# Altium schematic sheet DOC REVISION HISTORY.SchDoc
size A4; Organization: Deutsches Zentrum für Luft-; Address1: und Raumfahrt e.V. (DLR); Address2: Institut für Materialphysik; Address3: im Weltraum; Address4: Linder Höhe - 51147 Köln; DocumentNumber: 3; SheetNumber: 3; SheetTotal: 4
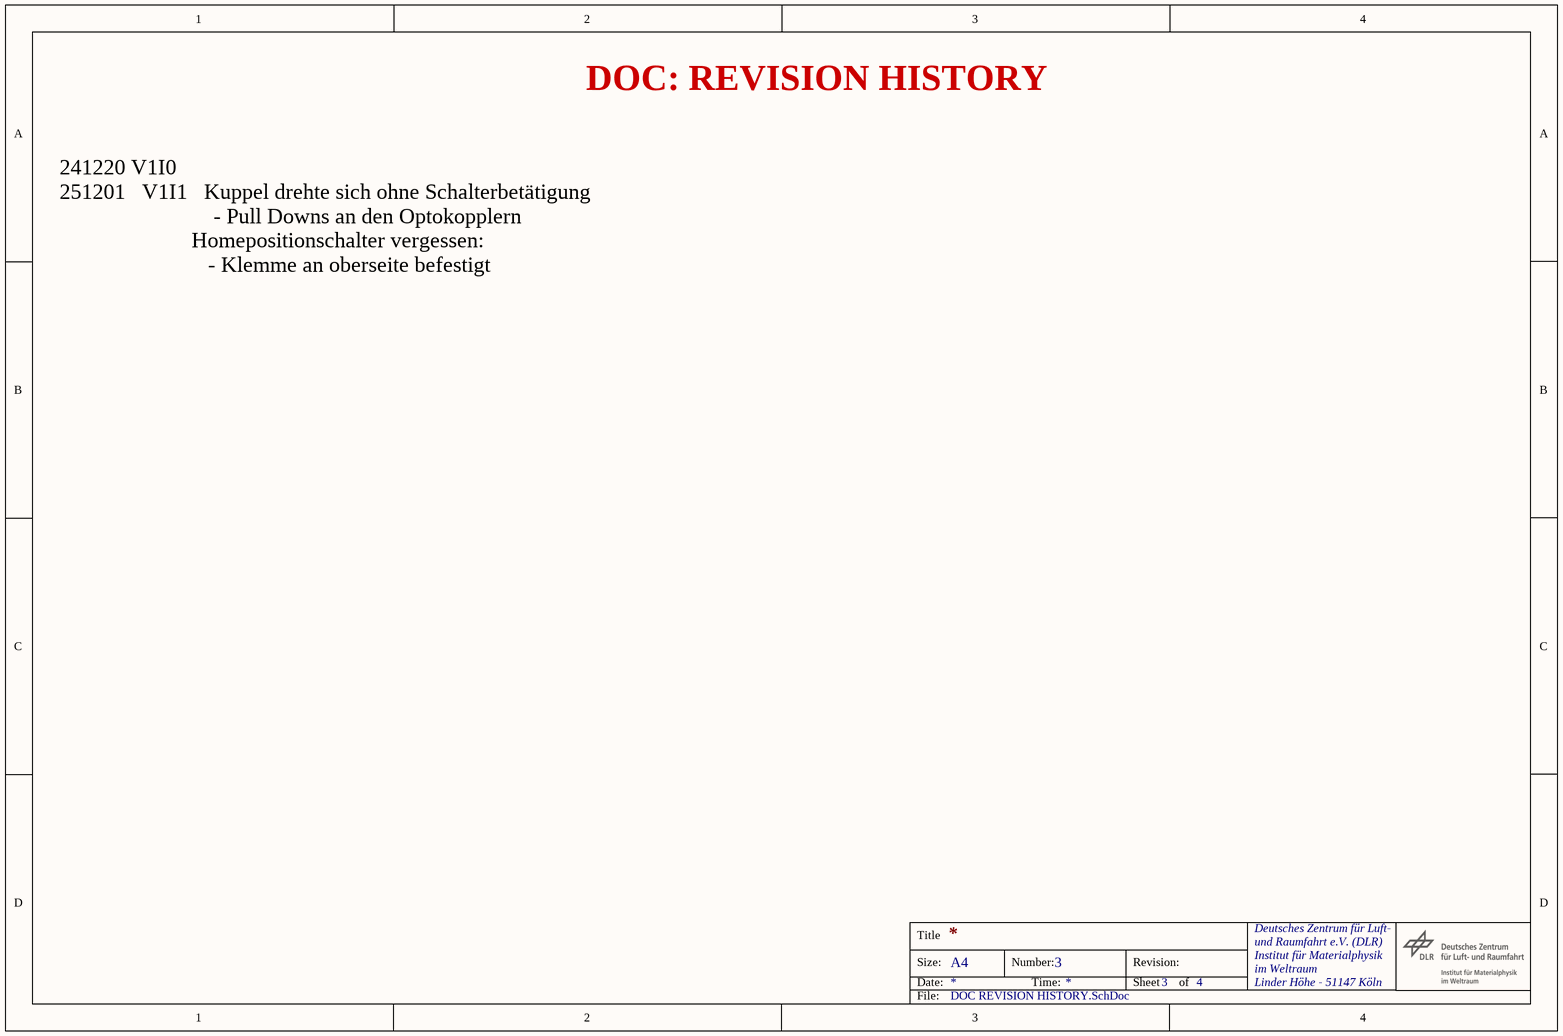
[diagram p0: DOC REVISION HISTORY.SchDoc]

## Notes on the sheet
- DOC: REVISION HISTORY
- 241220	V1I0
  251201   V1I1   Kuppel drehte sich ohne Schalterbetätigung
  - Pull Downs an den Optokopplern
  Homepositionschalter vergessen:
  - Klemme an oberseite befestigt
- Title
- Size:
- Date:
- A4
- Number:
- Time:
- Revision:
- Sheet
- of
- File: